# Altium schematic sheet mcu.SchDoc
size A4; SheetNumber: 5; SheetTotal: 11
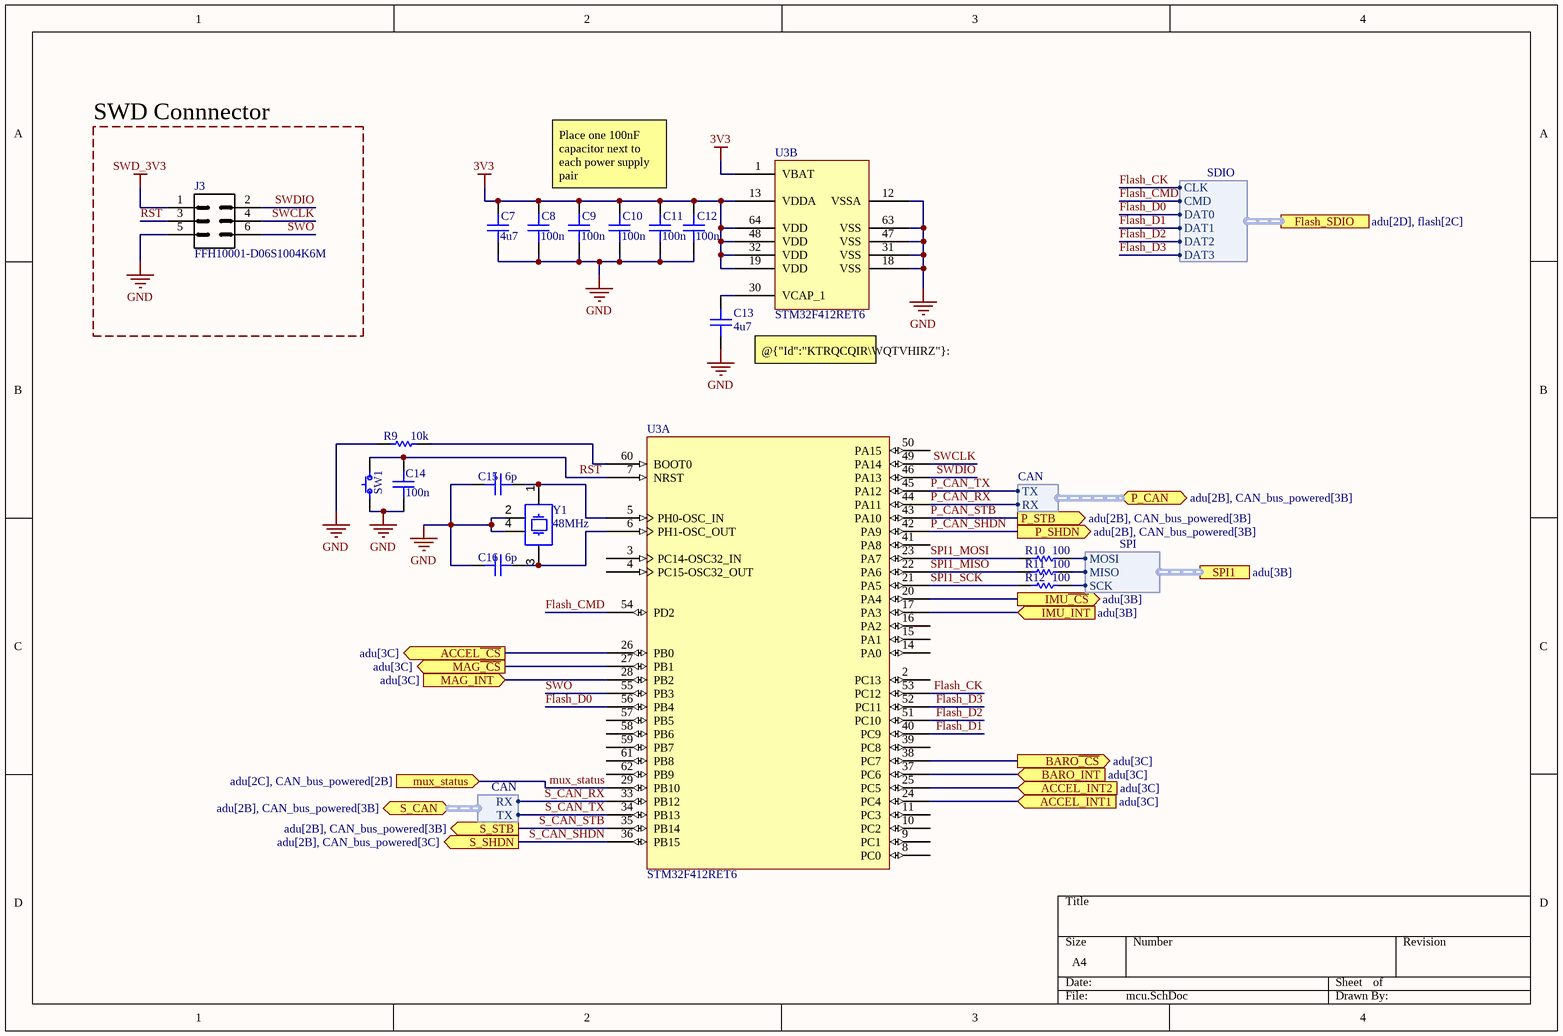
[diagram p0: mcu.SchDoc]

## Parts
C7  4u7  [CAP-0603-NP]
C8  100n  [CAP-0603-NP]
C9  100n  [CAP-0603-NP]
C10  100n  [CAP-0603-NP]
C11  100n  [CAP-0603-NP]
C12  100n  [CAP-0603-NP]
C13  4u7  [CAP-0603-NP]
C14  100n  [CAP-0603-NP]
C15  6p  [CAP-0603-NP]
C16  6p  [CAP-0603-NP]
J3  FFH10001-D06S1004K6M  [SOP127P600-8N]
R9  10k  [RES-0603]
R10  100  [RES-0603]
R11  100  [RES-0603]
R12  100  [RES-0603]
SW1  SPST Switch  [HYP 1TS026A-1000-0550-CT]  (value not drawn)
U3  STM32F412RET6  [STM32 LQFP64]  (parts A,B of 2)
Y1  48MHz  [XTAL_3.2x2.5mm]

## Blocks framed on the sheet
SWD Connnector: J3

## Ports
ACCEL_INT1 (in, see adu[3C]), ACCEL_INT2 (in, see adu[3C]), ACCEL~{_CS} (out, see adu[3C]), BARO_INT (in, see adu[3C]), BARO~{_CS} (out, see adu[3C]), Flash_SDIO (harness SDIO, see adu[2D], flash[2C]), IMU_INT (in, see adu[3B]), IMU~{_CS} (out, see adu[3B]), MAG_INT (in, see adu[3C]), MAG~{_CS} (out, see adu[3C]), mux_status (in, see adu[2C], CAN_bus_powered[2B]), P_CAN (bidir, harness CAN, see adu[2B], CAN_bus_powered[3B]), P_SHDN (out, see adu[2B], CAN_bus_powered[3B]), P_STB (out, see adu[2B], CAN_bus_powered[3B]), S_CAN (bidir, harness CAN, see adu[2B], CAN_bus_powered[3B]), S_SHDN (out, see adu[2B], CAN_bus_powered[3C]), S_STB (out, see adu[2B], CAN_bus_powered[3B]), SPI1 (harness SPI, see adu[3B])

## Harnesses
SDIO: CLK, CMD, DAT0, DAT1, DAT2, DAT3
SPI: MISO, SCK, MOSI
CAN: TX, RX

## Nets
3V3: C7.2 C8.2 C9.2 C10.2 C11.2 C12.2 U3.1(VBAT) U3.13(VDDA) U3.19(VDD) U3.32(VDD) U3.48(VDD) U3.64(VDD)
GND: C7.1 C8.1 C9.1 C10.1 C11.1 C12.1 C13.1 C14.1 C15.1 C16.1 J3.5 R9.1 SW1.1 U3.12(VSSA) U3.18(VSS) U3.31(VSS) U3.47(VSS) U3.63(VSS) Y1.2(GND) Y1.4(GND)
SWD_3V3: J3.1
ACCEL~{_CS}: U3.26(PB0) ; port ACCEL~{_CS}
ACCEL_INT1: U3.24(PC4) ; port ACCEL_INT1
ACCEL_INT2: U3.25(PC5) ; port ACCEL_INT2
BARO~{_CS}: U3.38(PC7) ; port BARO~{_CS}
BARO_INT: U3.37(PC6) ; port BARO_INT
Flash_CK: U3.53(PC12) ; port Flash_SDIO.CLK
Flash_CMD: U3.54(PD2) ; port Flash_SDIO.CMD
Flash_D0: U3.56(PB4) ; port Flash_SDIO.DAT0
Flash_D1: U3.40(PC9) ; port Flash_SDIO.DAT1
Flash_D2: U3.51(PC10) ; port Flash_SDIO.DAT2
Flash_D3: U3.52(PC11) ; port Flash_SDIO.DAT3
IMU~{_CS}: U3.20(PA4) ; port IMU~{_CS}
IMU_INT: U3.17(PA3) ; port IMU_INT
MAG~{_CS}: U3.27(PB1) ; port MAG~{_CS}
MAG_INT: U3.28(PB2) ; port MAG_INT
mux_status: U3.29(PB10) ; port mux_status
P_CAN_RX: U3.44(PA11) ; port P_CAN.RX
P_CAN_SHDN: U3.42(PA9) ; port P_SHDN
P_CAN_STB: U3.43(PA10) ; port P_STB
P_CAN_TX: U3.45(PA12) ; port P_CAN.TX
RST: C14.2 J3.3 SW1.2 U3.7(NRST)
S_CAN_RX: U3.33(PB12) ; port S_CAN.RX
S_CAN_SHDN: U3.36(PB15) ; port S_SHDN
S_CAN_STB: U3.35(PB14) ; port S_STB
S_CAN_TX: U3.34(PB13) ; port S_CAN.TX
SPI1_MISO: R11.2 U3.22(PA6)
SPI1_MOSI: R10.2 U3.23(PA7)
SPI1_SCK: R12.2 U3.21(PA5)
SWCLK: J3.4 U3.49(PA14)
SWDIO: J3.2 U3.46(PA13)
SWO: J3.6 U3.55(PB3)
NetC13_2: C13.2 U3.30(VCAP_1)
NetC15_2: C15.2 U3.5(PH0-OSC_IN) Y1.1(X1)
NetC16_2: C16.2 U3.6(PH1-OSC_OUT) Y1.3(X2)
NetR9_2: R9.2 U3.60(BOOT0)
NetR10_1: R10.1 ; port SPI1.MOSI
NetR11_1: R11.1 ; port SPI1.MISO
NetR12_1: R12.1 ; port SPI1.SCK

Not connected (* = marked no-connect by the designer): U3 2(PC13) 3(PC14-OSC32_IN) 4(PC15-OSC32_OUT) 8(PC0) 9(PC1) 10(PC2) 11(PC3) 14(PA0) 15(PA1) 16(PA2) 39(PC8) 41(PA8) 50(PA15) 57(PB5) 58(PB6) 59(PB7) 61(PB8) 62(PB9)

## Notes on the sheet
- Place one 100nF capacitor next to each power supply pair
- @{"Id":"KTRQCQIR\WQTVHIRZ"}: ESR < 1 Ohm

## Library data of the parts
C7-C16 = Capacitor
J3 = Connector 6-Pin 2 Row
R9-R12 = Resistor
SW1 = SW_SPST: HYP (Hongyuan Precision) 1TS026A-1000-0550-CT
U3 = STM32F412RET6: 512KB 1.7V~3.6V ARM Cortex-M4 256KB 100MHz FLASH 50 LQFP-64(10x10) Microcontroller Units (MCUs/MPUs/SOCs) ROHS
Y1 = XTAL-4Pin: HCI XC32M4-48.000-F08NLDT / 8pF load capacitance